# Altium schematic sheet BoPhat.SchDoc
size A; SheetNumber: 3; SheetTotal: 3
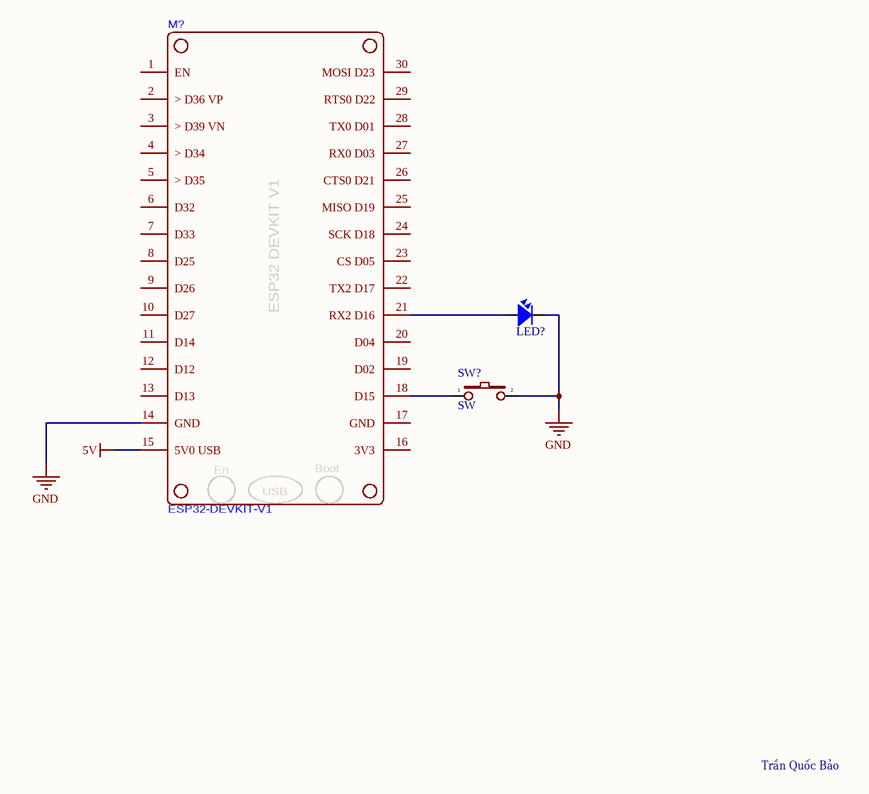
[diagram p0: BoPhat.SchDoc]

## Parts
LED?  LED  [LED-3]  (value not drawn)
M?  ESP32-DEVKIT-V1  [ESP32]
SW?  SW  [SW2]

## Nets
5V: M?.15(5V0_USB)
GND: LED?.2 M?.14(GND) SW?.2
NetLED?_1: LED?.1 M?.21(RX2_D16)
NetM?_18: M?.18(D15) SW?.1

Not connected (* = marked no-connect by the designer): M? 1(EN) 2(>_D36_VP) 3(>_D39_VN) 4(>_D34) 5(>_D35) 6(D32) 7(D33) 8(D25) 9(D26) 10(D27) 11(D14) 12(D12) 13(D13) 16(3V3) 17(GND) 19(D02) 20(D04) 22(TX2_D17) 23(CS_D05) 24(SCK_D18) 25(MISO_D19) 26(CTS0_D21) 27(RX0_D03) 28(TX0_D01) 29(RTS0_D22) 30(MOSI_D23)

## Notes on the sheet
- Trần Quốc Bảo
- (in symbol ESP32-DEVKIT-V1) ESP32 DEVKIT V1; En; Boot; USB

## Library data of the parts
LED? = LED: LED Single colour Green and Red; Value: LED 3 ly Single Colour
SW? = SW2: Switch button 2 pin; Value: SW chip 2 pin